# EAGLE design edge-lord-2000 (EAGLE 9.6.2)
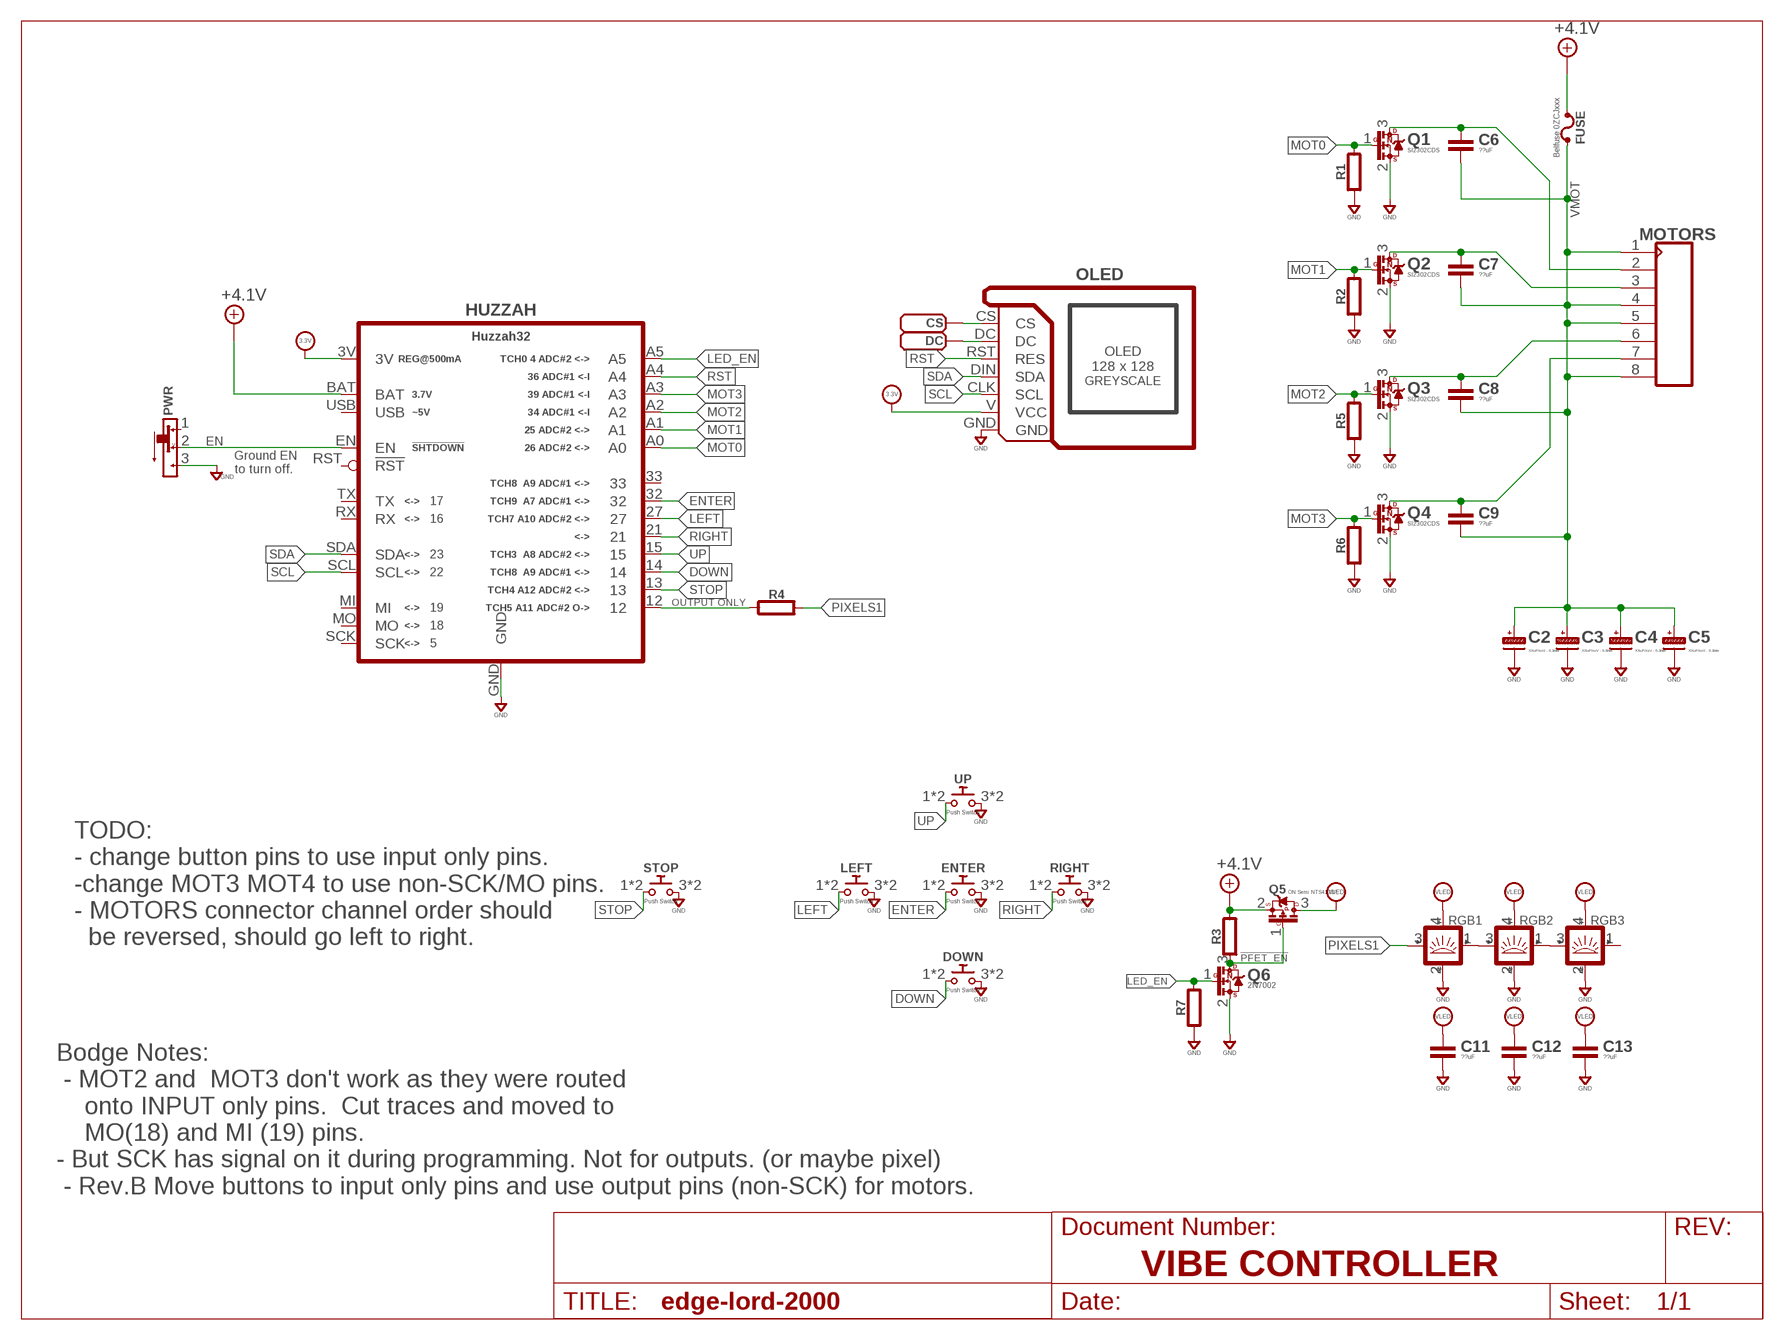
[diagram p0: schematic, sheet 1]
FRAME1 (LETTER_L): DOCUMENT_NUMBER: VIBE CONTROLLER

## Parts
C2  XXuF/xxV - 6.3mm  CAPACITOR_POL-ALUM-SMT-6.3  [CAP_ALUM_SMT_6.3]
C3  XXuF/xxV - 6.3mm  CAPACITOR_POL-ALUM-SMT-6.3  [CAP_ALUM_SMT_6.3]
C4  XXuF/xxV - 6.3mm  CAPACITOR_POL-ALUM-SMT-6.3  [CAP_ALUM_SMT_6.3]
C5  XXuF/xxV - 6.3mm  CAPACITOR_POL-ALUM-SMT-6.3  [CAP_ALUM_SMT_6.3]
C6  ??uF  CAPACITOR0603  [0603-CAP]
C7  ??uF  CAPACITOR0603  [0603-CAP]
C8  ??uF  CAPACITOR0603  [0603-CAP]
C9  ??uF  CAPACITOR0603  [0603-CAP]
C11  ??uF  CAPACITOR0603  [0603-CAP]
C12  ??uF  CAPACITOR0603  [0603-CAP]
C13  ??uF  CAPACITOR0603  [0603-CAP]
CS  PADSMD-070X070  [SMD-070MIL]
DC  PADSMD-070X070  [SMD-070MIL]
DOWN  Push Switch  PUSHBTN-MOMB3SN  [B3SN]
ENTER  Push Switch  PUSHBTN-MOMB3SN  [B3SN]
FUSE  Belfuse 0ZCJxxx  FUSEPOLY-1206  [BELFUSE-1206]
HUZZAH  Huzzah32  HUZZAHHUZZAH  [ADAFRUIT_HUZZAH32]
LEFT  Push Switch  PUSHBTN-MOMB3SN  [B3SN]
MOTORS  CON_08X1-RA-THD  [MA08X1-RA-THD]
OLED  GREYSCALE  OLED_128X128_MODULE-128X128-MONO-30MM  [SSD1327-THD-MODULE]
PWR  SLIDE-SPDTJS102011JCQN  [CK_JS102011JCQN]
Q1  SI2302CDS  N-FET_SI2302  [SOT-23]
Q2  SI2302CDS  N-FET_SI2302  [SOT-23]
Q3  SI2302CDS  N-FET_SI2302  [SOT-23]
Q4  SI2302CDS  N-FET_SI2302  [SOT-23]
Q5  ON Semi NTS4173P  P-FETSOT-323  [SOT-323]
Q6  2N7002  N-FET_2N7002  [SOT-23]
R1  100K  RESISTOR0603  [0603-RES]
R2  100K  RESISTOR0603  [0603-RES]
R3  20K  RESISTOR0603  [0603-RES]
R4  330  RESISTOR0603  [0603-RES]
R5  100K  RESISTOR0603  [0603-RES]
R6  100K  RESISTOR0603  [0603-RES]
R7  100K  RESISTOR0603  [0603-RES]
RGB1  SMART_LED3535  [SMD_3535]
RGB2  SMART_LED3535  [SMD_3535]
RGB3  SMART_LED3535  [SMD_3535]
RIGHT  Push Switch  PUSHBTN-MOMB3SN  [B3SN]
STOP  Push Switch  PUSHBTN-MOMB3SN  [B3SN]
UP  Push Switch  PUSHBTN-MOMB3SN  [B3SN]

## Nets
!PFET_EN: Q5.1(G) Q6.3(D) R3.1
+3.3V: HUZZAH.3V OLED.V(VCC) ; supply symbol labelled 3.3V
+4.1V: FUSE.1 HUZZAH.BAT Q5.2(S) R3.2
DOWN: DOWN.1 DOWN.2 HUZZAH.14
EN: HUZZAH.EN PWR.2
ENTER: ENTER.1 ENTER.2 HUZZAH.32
GND: C2.-(N) C3.-(N) C4.-(N) C5.-(N) C11.2 C12.2 C13.2 DOWN.3 DOWN.4 ENTER.3 ENTER.4 HUZZAH.GND LEFT.3 LEFT.4 OLED.GND PWR.3 Q1.2(S) Q2.2(S) Q3.2(S) Q4.2(S) Q6.2(S) R1.1 R2.1 R5.1 R6.1 R7.1 RGB1.2(GND) RGB2.2(GND) RGB3.2(GND) RIGHT.3 RIGHT.4 STOP.3 STOP.4 UP.3 UP.4
LED_EN: HUZZAH.A5 Q6.1(G) R7.2
LEFT: HUZZAH.27 LEFT.1 LEFT.2
MOT0: HUZZAH.A0 Q1.1(G) R1.2
MOT1: HUZZAH.A1 Q2.1(G) R2.2
MOT2: HUZZAH.A2 Q3.1(G) R5.2
MOT3: HUZZAH.A3 Q4.1(G) R6.2
N$2: C6.1 MOTORS.2 Q1.3(D)
N$3: C8.1 MOTORS.6 Q3.3(D)
N$4: C7.1 MOTORS.3 Q2.3(D)
N$6: CS.1(PAD) OLED.CS
N$7: DC.1(PAD) OLED.DC
N$8: RGB1.1(OUT) RGB2.3(IN)
N$9: RGB2.1(OUT) RGB3.3(IN)
N$32: HUZZAH.12 R4.1
N$33: C9.1 MOTORS.7 Q4.3(D)
PIXELS1: R4.2 RGB1.3(IN)
RIGHT: HUZZAH.21 RIGHT.1 RIGHT.2
RST: HUZZAH.A4 OLED.RST(RES)
SCL: HUZZAH.SCL OLED.CLK(SCL)
SDA: HUZZAH.SDA OLED.DIN(SDA)
STOP: HUZZAH.13 STOP.1 STOP.2
UP: HUZZAH.15 UP.1 UP.2
VLED: C11.1 C12.1 C13.1 Q5.3(D) RGB1.4(VDD) RGB2.4(VDD) RGB3.4(VDD)
VMOT: C2.+(P) C3.+(P) C4.+(P) C5.+(P) C6.2 C7.2 C8.2 C9.2 FUSE.2 MOTORS.1 MOTORS.4 MOTORS.5 MOTORS.8
Unconnected: HUZZAH.33 HUZZAH.MI HUZZAH.MO HUZZAH.RST(!RST) HUZZAH.RX HUZZAH.SCK HUZZAH.TX HUZZAH.USB PWR.1 RGB3.1(OUT)

## Notes on the sheet
- Ground EN
  to turn off.
- OUTPUT ONLY
- TODO:
  - change button pins to use input only pins.
  -change MOT3 MOT4 to use non-SCK/MO pins.
  - MOTORS connector channel order should
    be reversed, should go left to right.
- Bodge Notes:
   - MOT2 and  MOT3 don't work as they were routed
      onto INPUT only pins.  Cut traces and moved to
      MO(18) and MI (19) pins.  
  - But SCK has signal on it during programming. Not for outputs. (or maybe pixel)
   - Rev.B Move buttons to input only pins and use output pins (non-SCK) for motors.

## Library data of the parts
C2-C5 = rlc:CAPACITOR_POL: Polarized Capacitor
C6-C9 C11-C13 = rlc:CAPACITOR: Capacitor; COST01: 0.12; COST10: 0.09; COST100: 0.05
CS DC = con-testpoints:PAD: Solder Pad
DOWN ENTER LEFT RIGHT STOP UP = switch-smd:PUSHBTN-MOM: Pushbutton Switch; COST01: 1.05; COST10: 0.95; COST100: 0.75; MFR: Omron; MPN: B3SN
FUSE = fuse:FUSE: Fuse
HUZZAH = co-espressif:HUZZAH: AdaFruit Huzzah32
MOTORS = con-headers:CON_08X1: Header, 8-pin, 1-row, 2.54mm
OLED = display-lcd-oled:OLED_128X128_MODULE: OLED Module, THD, COLOR, 128x128; COST01: 20.00; MFR: Amazon; MPN: B079NNZ9V1
PWR = switch-smd:SLIDE-SPDT: Slide Switch - SPDT
Q1-Q4 = transistor-fet:N-FET: FET
Q5 = transistor-fet:P-FET: P-FET (PFET); COST01: 0.45; COST10: 0.35; COST100: 0.25; MFR: ONsemi; MPN: NTS4173
Q6 = transistor-fet:N-FET: FET; COST01: 0.20; COST10: 0.16; COST100: 0.09; IDS: 0.2A; MPN: 2N7002; RDS: 0.05 ohm
R1-R7 = rlc:RESISTOR: Resistor; COST01: 0.10; COST10: 0.05; COST100: 0.02
RGB1-RGB3 = led:SMART_LED: Smart LED SK6812 WS2812; COST01: 0.60; COST10: 0.50; COST100: 0.40

## Board
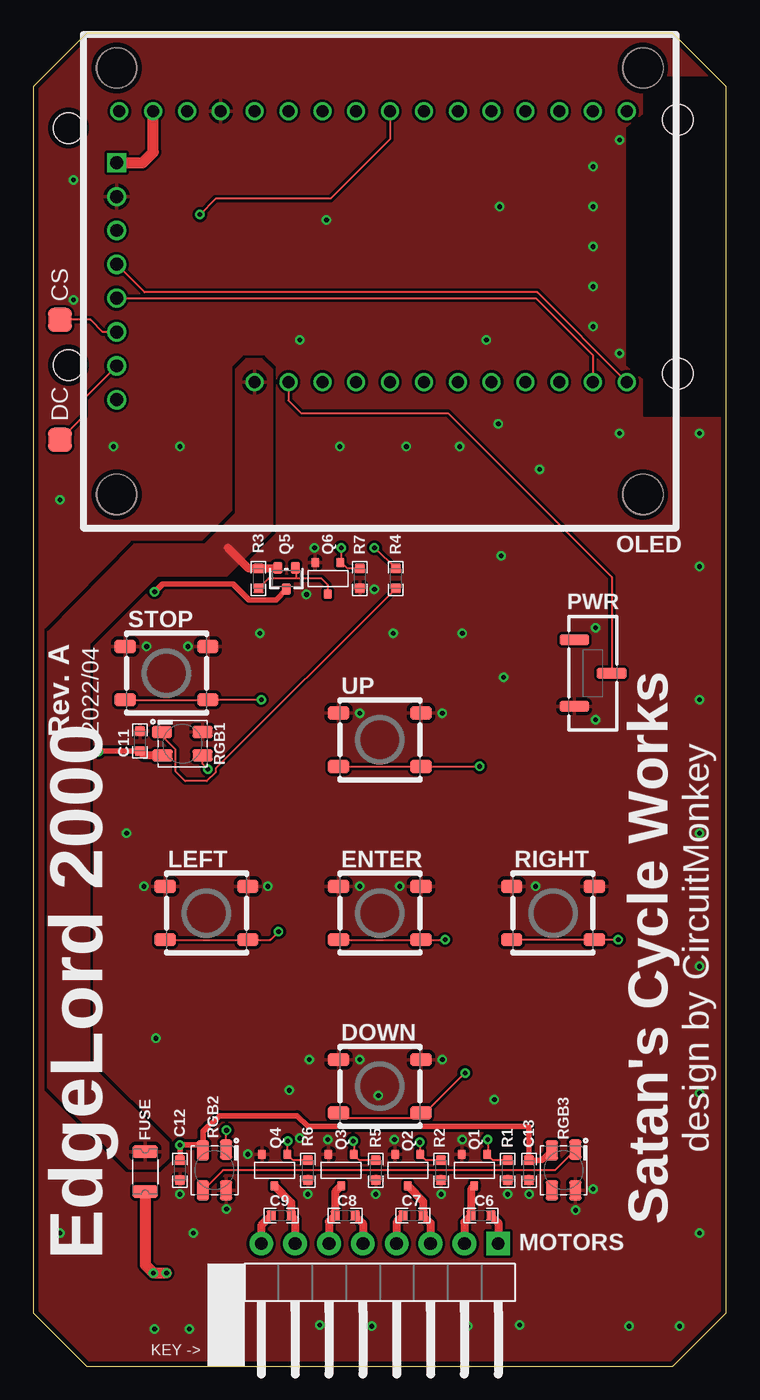
[diagram p1: board, top side]
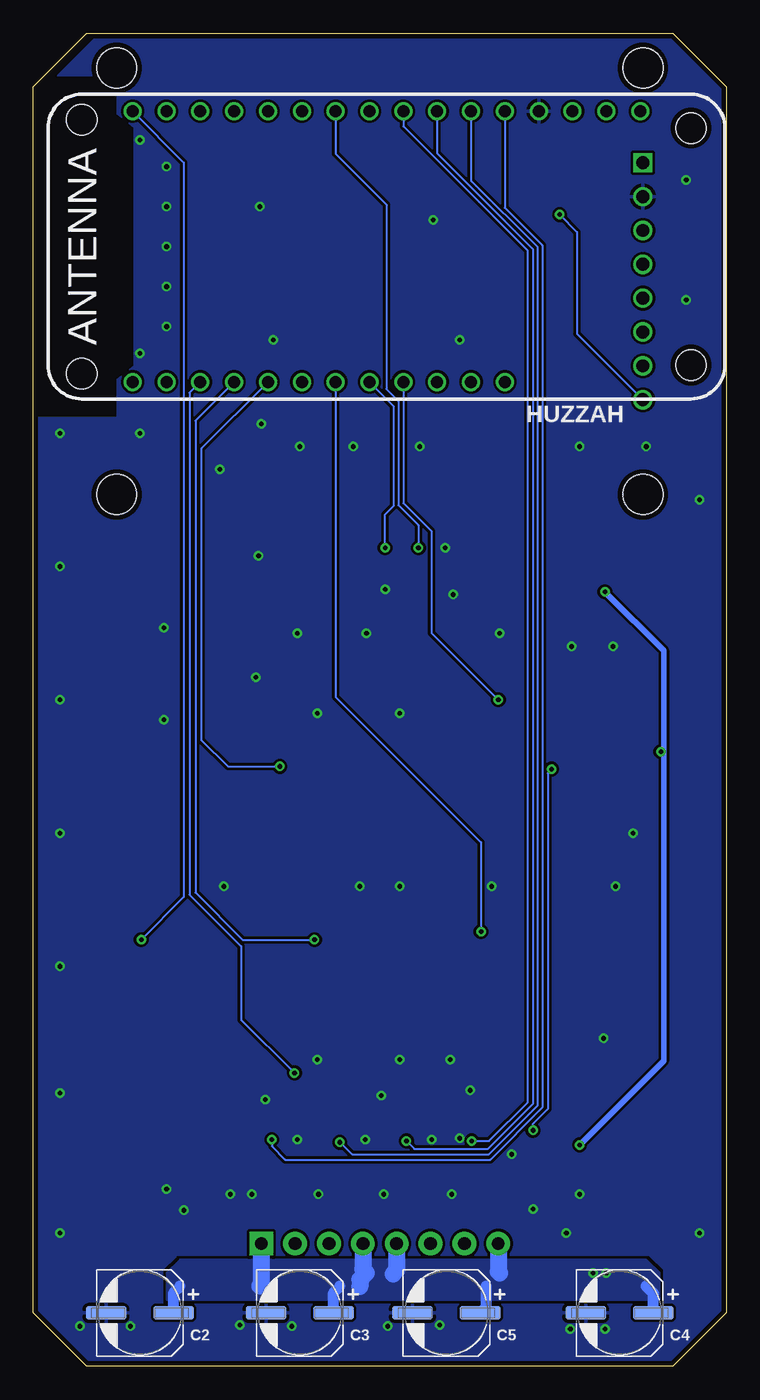
[diagram p2: board, bottom side, seen from below]

Size 52 x 100 mm. Coordinates in mm from the lower left corner, seen from the top.
Outline: 0,96 0,4 4,0 48,0 52,4 52,96 48,100 4,100 0,96
Copper layers (1*16): Top 0.0356mm / dielectric 1.5011mm / Bottom 0.0356mm
Design rules "OSH-CircuitMonkey *": minimum track width 6mil, minimum drill 13mil, track to track 0.2mm, track to pad 6mil, pad to pad 6mil, via to via 6mil, smd to smd 6mil, copper to edge 15mil, drill to drill 6mil, minimum pad ring 7mil, minimum via ring 7mil, stop-mask expansion 3mil, vias tented up to drill 14mil, thermal gap 10mil
Holes 3 mm at 6.25,97.4 6.25,65.4 45.75,65.4 45.75,97.4
Holes 2.29 mm at 2.64,75.11 48.36,74.47 48.36,93.53 2.64,92.89

### Footprints (pad centres in the part's own frame; a part is rotated, then mirrored left to right if it is on the bottom)
CAP_ALUM_SMT_6.3 = smd 3.048 x 1.016: + 2.54,0; - -2.54,0
0603-CAP = smd 0.711 x 0.762: 1 -0.752,0; 2 0.752,0
SMD-070MIL = smd 1.778 x 1.778: 1 0.508,0
B3SN = smd 1.6 x 1: 1 3.1,-2; 2 -3.1,-2; 3 3.1,2; 4 -3.1,2
BELFUSE-1206 = smd 1 x 1.9: 1 -1.5,0; 2 1.5,0
ADAFRUIT_HUZZAH32 = drill 0.9: 3V -16.51,-10.16; 12 1.27,10.16; 13 -1.27,10.16; 14 13.97,10.16; 15 8.89,10.16; 21 19.05,-10.16; 27 3.81,10.16; 32 11.43,10.16; 33 6.35,10.16; A0 -8.89,-10.16; A1 -6.35,-10.16; A2 -3.81,-10.16; A3 -1.27,-10.16; A4 1.27,-10.16; A5 3.81,-10.16; BAT -8.89,10.16; EN -6.35,10.16; GND -11.43,-10.16; MI 11.43,-10.16; MO 8.89,-10.16; NC -13.97,-10.16; RST -19.05,-10.16; RX 13.97,-10.16; SCK 6.35,-10.16; SCL 16.51,10.16; SDA 19.05,10.16; TX 16.51,-10.16; USB -3.81,10.16 | hole 2.286: -22.86,8.89; 22.86,9.525; 22.86,-9.525; -22.86,-8.89
MA08X1-RA-THD = drill 0.965 pad 1.778 square: 1 -8.89,0 | drill 0.965 pad 1.778: 2 -6.35,0; 3 -3.81,0; 4 -1.27,0; 5 1.27,0; 6 3.81,0; 7 6.35,0; 8 8.89,0
SSD1327-THD-MODULE = drill 0.965: CLK -19.75,-1.27; CS -19.75,-3.81; DC -19.75,-6.35; DIN -19.75,1.27; GND -19.75,6.35; NC -19.75,3.81; RST -19.75,-8.89 | drill 0.965 square: V -19.75,8.89 | hole 3: -19.75,16; -19.75,-16; 19.75,-16; 19.75,16
CK_JS102011JCQN = smd 0.8 x 2.2: 1 -2.5,-1.4; 2 0,1.4; 3 2.5,-1.4
SOT-23 = smd 0.6 x 0.7: 1 -0.95,-1.18; 2 0.95,-1.18; 3 0,1.18
SOT-323 = smd 0.7 x 0.9: 1 -0.65,-0.8; 2 0.65,-0.8; 3 0,0.8
0603-RES = smd 0.711 x 0.762: 1 -0.752,0; 2 0.752,0
SMD_3535 = smd 1.5 x 0.9: 1 -1.5,0.875; 2 -1.5,-0.875; 3 1.55,-0.875; 4 1.5,0.875

### Placement (x,y rotation side)
C2  44,4 0 bottom
C3  32,4 0 bottom
C4  8,4 0 bottom
C5  21,4 0 bottom
C6  33.6,11.3 0 top
C7  28.5,11.3 180 top
C8  23.4,11.3 0 top
C9  18.6,11.3 180 top
C11  8,46.9 90 top
C12  11,14.7 270 top
C13  37.2,14.7 270 top
CS  2,78 90 top
DC  2,69 90 top
DOWN  26,21 0 top
ENTER  26,34 0 top
FUSE  8.4,14.6 270 top
HUZZAH  25.5,84 180 bottom
LEFT  13,34 0 top
MOTORS  26,9.2 180 top
OLED  26,81.4 0 top
PWR  42,52 270 top
Q1  33.1,14.7 180 top
Q2  28.1,14.7 180 top
Q3  23.1,14.7 180 top
Q4  18.1,14.7 180 top
Q5  19,59.1 180 top
Q6  22.1,59.1 180 top
R1  35.6,14.7 90 top
R2  30.6,14.7 90 top
R3  16.9,59.1 90 top
R4  27.2,59.1 270 top
R5  25.7,14.7 90 top
R6  20.6,14.7 90 top
R7  24.5,59.1 90 top
RGB1  11.2,46.7 180 top
RGB2  13.6,14.7 90 top
RGB3  39.8,14.7 90 top
RIGHT  39,34 0 top
STOP  10,52 0 top
UP  26,47 0 top

### Tracks (layer width: path | path; a pad name or v marks a point on that pad's centre or on a via)
!PFET_EN
  Top 0.152: R3.1 17.65,59.1 19.7,59.1 | Q6.3 22.1,58.62 21.62,59.1 19.7,59.1 | Q5.1 19.7,59.85 19.7,59.1
+3.3V
  Top 0.813: OLED.V 8.19,90.29 9,91.1 HUZZAH.3V
+4.1V
  Top 0.61: 14.6,61.4 16.15,59.85 R3.2 18.2,59.85 18.25,59.9 Q5.2
  pour Top: 9.3,14.8 7.2,14.8 1.1,20.9 1.1,55.1 7.6,61.7 12.9,61.7 15.2,64 15.2,74.8 16,75.6 17.1,75.6 17.9,74.8 17.9,62.7 14.5,59.3 9.3,59.3 4.2,54.2 4.2,22.7 10.1,16.8 10.1,15.6
DOWN  (via drill 0.35)
  Top 0.152: DOWN.2 23.3,18.6 28.7,18.6 DOWN.1 29.4,19.3 29.7,19.3 v32.4,22
  Bottom 0.152: HUZZAH.14 40.27,73.04 40.27,35.37 36.4,31.5 36.4,26 v32.4,22
EN
  Top 0.152: HUZZAH.EN 19.15,72.45 20.1,71.5 31.1,71.5 43.4,59.2 PWR.2
ENTER  (via drill 0.35)
  Top 0.152: ENTER.2 ENTER.1 v30.9,32
  Bottom 0.152: HUZZAH.32 39.83,70.94 39.83,35.53 36.3,32 v30.9,32
GND  (via drill 0.35)
  other vias: 21.1,61.4 25.6,58.3 20.5,57.9 11.6,54 8.5,54 24.5,49 30.7,49 37.7,36 42.2,55.4 42.2,48.5 27.5,36 24.5,36 17.6,36 8.3,36 24.5,23 20.7,23 30.7,23 19.2,20.7 9.2,24.6 14.5,11.8 40.7,11.7 37.2,12.9 35.6,12.9 30.6,12.9 25.7,12.9 20.6,12.9 27.1,17 32.2,17 16.1,15.9 11,12.9 11.7,2.8 9.1,2.8 21.5,3.1 25.4,3 32.6,3 36.5,3.1 44.7,3 48.5,3 42,13.3 50,10 50,20.5 50,30 50,40 50,50 50,60 50,70 2,65 7,40 2,10 12,10 42,90 42,87 42,84 42,81 42,78 44,76 44,92 35,87 22,86 20,77 34,77 3,89 3,80 38,67.3 34.9,70.7 32,69 28,69 23,69 11,69 6,69 44,70 35.1,60.8 35.3,51.7 32.2,55 27,55 17,55 22.1,17 20,17.1 25.9,20.3 34.6,20
  pour Bottom (rank 5): 0,0 50.5,0 52,1.5 52,95 47,100 0,100
  pour Top (rank 5): 0,0 52,0 52,100 0,100
LED_EN  (via drill 0.35)
  Top 0.152: v23.1,61.4 23.1,60.33 | 23.1,60.33 Q6.1 | R7.2 23.58,59.85 23.1,60.33
  Bottom 0.152: HUZZAH.A5 29.31,90.96 25.51,87.16 25.51,73.31 24.6,72.4 24.6,64.6 23.1,63.1 v23.1,61.4
LEFT  (via drill 0.35)
  Top 0.152: LEFT.2 LEFT.1 17.8,32 v18.4,32.6
  Bottom 0.152: HUZZAH.27 29.31,50.21 18.4,39.3 v18.4,32.6
MOT0  (via drill 0.35)
  Top 0.152: v34.1,17 34.1,15.93 Q1.1 34.48,15.45 R1.2
  Bottom 0.152: HUZZAH.A0 16.61,86.91 13.79,84.09 13.79,19.41 17.7,15.5 33.1,15.5 34.1,16.5 v34.1,17
MOT1  (via drill 0.35)
  Top 0.152: v29,16.8 29,15.93 Q2.1 29.48,15.45 R2.2
  Bottom 0.152: HUZZAH.A1 19.15,88.95 14.15,83.95 14.15,19.55 17.8,15.9 28.1,15.9 v29,16.8
MOT2  (via drill 0.35)
  Top 0.152: v24,16.9 24.05,16.85 Q3.1 24.48,15.45 R5.2
  Bottom 0.152: HUZZAH.A2 21.69,90.99 14.5,83.8 14.5,19.7 17.9,16.3 23.4,16.3 v24,16.9
MOT3  (via drill 0.35)
  Top 0.152: v19.1,16.9 19.05,16.85 19.05,15.9 | 19.05,15.9 Q4.1 | R6.2 19.5,15.45 19.05,15.9
  Bottom 0.152: HUZZAH.A3 24.23,93.03 14.9,83.7 14.9,19.8 17.8,16.9 v19.1,16.9
N$2
  Top 0.61: Q1.3 32.85,13.27 C6.1 32.35,10.8 MOTORS.2
N$3
  Top 0.61: MOTORS.6 22.19,10.84 C8.1 22.65,13.07 Q3.3
N$4
  Top 0.61: Q2.3 29.25,12.37 C7.1 29.81,10.74 MOTORS.3
N$6
  Top 0.152: OLED.CS 5.22,77.59 4.3,78.51 CS.1
N$7
  Top 0.152: OLED.DC 3.8,72.6 3.8,71.31 DC.1
N$8  (via drill 0.35)
  Top 0.152: RGB2.3 14.47,17.68 v14.5,17.7 | v13.1,44.8 12.7,45.2 RGB1.1
  Bottom 0.152: v14.5,17.7 14.5,18.2 13.4,19.3 13.4,44.5 v13.1,44.8
N$9
  Top 0.152: RGB3.3 39.12,14.7 14.22,14.7 RGB2.1
N$32  (via drill 0.35)
  Top 0.152: v25.6,61.4 25.65,61.4 R4.1
  Bottom 0.152: v25.6,61.4 25.6,63.9 24.97,64.53 24.97,72.04 HUZZAH.12
N$33
  Top 0.61: MOTORS.7 19.65,11 C9.1 19.35,12.27 Q4.3
PIXELS1
  Top 0.152: R4.2 13.68,44.83 13.68,44.56 13.02,43.9 11.4,43.9 10.68,44.62 10.68,46.26 9.65,47.29 RGB1.3
RIGHT  (via drill 0.35)
  Top 0.152: v43.9,32 RIGHT.1 RIGHT.2
  Bottom 0.152: HUZZAH.21 40.7,90.31 40.7,35.2 v43.9,32
RST  (via drill 0.35)
  Top 0.152: HUZZAH.A4 26.77,92.07 22.3,87.6 13.7,87.6 v12.5,86.4
  Bottom 0.152: v12.5,86.4 11.2,85.1 11.2,77.46 OLED.RST
SCL
  Top 0.152: OLED.CLK 37.72,80.13 42.01,75.84 HUZZAH.SCL
SDA
  Top 0.152: OLED.DIN 8.35,80.57 37.82,80.57 HUZZAH.SDA
STOP  (via drill 0.35)
  Top 0.152: v17.1,50 STOP.1 STOP.2
  Bottom 0.152: HUZZAH.13 24.23,64.75 22.12,62.64 22.12,55.02 v17.1,50
UP  (via drill 0.35)
  Top 0.152: UP.2 UP.1 v33.5,45
  Bottom 0.152: HUZZAH.15 39.39,68.84 39.39,46.99 37.4,45 v33.5,45
VLED  (via drill 0.35)
  Top 0.406: Q5.3 18.2,57.5 16.2,57.5 15,58.7 9.7,58.7 v9.1,58.1 | C12.1 v11,16.6 12.5,16.6 12.7,16.4 12.7,16.23 RGB2.4 12.72,17.62 13.1,18 13.9,18.7 14,18.8 19.8,18.8 20.6,18 37.2,18 C13.1 38.18,15.45 RGB3.4 | C11.1 4.95,46.15 v4.9,46.1
  Top 0.61: RGB1.4 8.32,45.83 C11.1
  Bottom 0.406: v9.1,58.1 4.7,53.7 4.7,46.1 | 4.7,46.1 4.7,22.9 v11,16.6 | v4.9,46.1 4.7,46.1
VMOT  (via drill 0.35)
  Top 0.61: C9.2 17.11,10.56 MOTORS.8 | C8.2 24.73,10.72 MOTORS.5 | C7.2 27.27,10.82 MOTORS.4 | C6.2 34.89,10.76 MOTORS.1
  Top 0.813: FUSE.2 8.4,7.6 v9,7 v10,7
  Bottom 0.813: C3.+ 29.46,5.54 29,6 | C5.+ 18,4.46 18,6 | C4.+ 5.46,5.46 6,6 | C2.+ 41.46,5.54 41,6
  Bottom 1.27: MOTORS.1 34.89,6.11 35,6 | MOTORS.4 27.27,7.27 27,7 27.5,6.5 27.5,5.96 | MOTORS.5 24.73,7.2 25,6.93 | MOTORS.8 17.11,7.11 17,7
  pour Bottom: 6,8 41,8 42,7 42,5 5,5 5,7

### Text on the board
tPlace: Rev. A | 2022/04 | Satan's Cycle Works | design by CircuitMonkey | EdgeLord 2000 | KEY ->